# Altium schematic sheet Power.SchDoc
size 127 x 177 mm; SheetNumber: 1; SheetTotal: 5
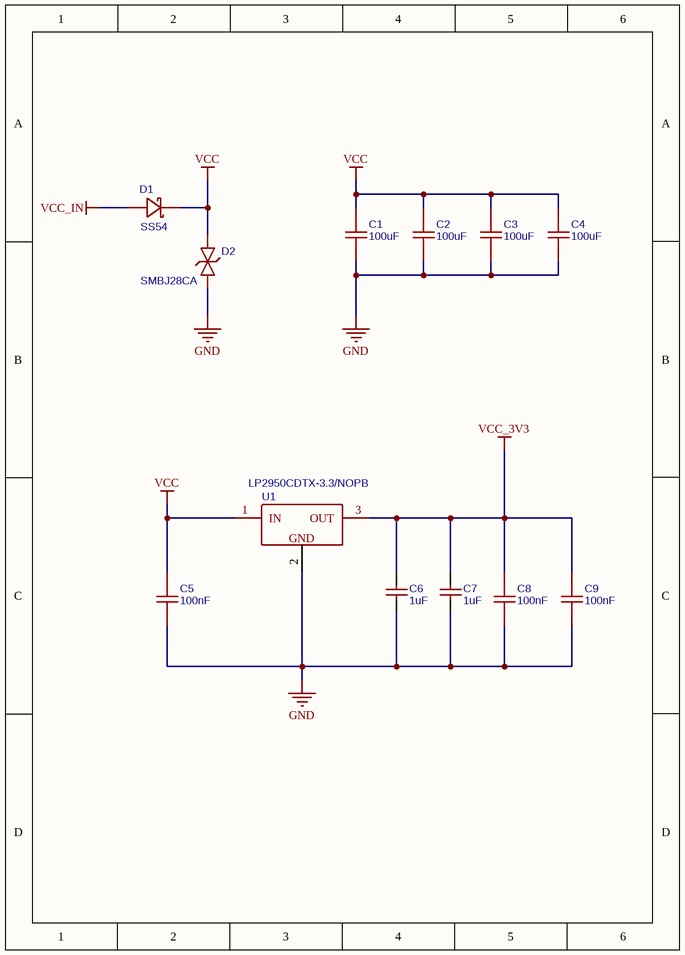
[diagram p0: Power.SchDoc]

## Parts
C1  100uF  [C1206]
C2  100uF  [C1206]
C3  100uF  [C1206]
C4  100uF  [C1206]
C5  100nF  [C0603]
C6  1uF  [C0603]
C7  1uF  [C0603]
C8  100nF  [C0603]
C9  100nF  [C0603]
D1  SS54  [SMA_L4.3-W2.6-LS5.0-RD]
D2  SMBJ28CA  [SMB_L4.6-W3.6-LS5.3-BI]
U1  LP2950CDTX-3.3/NOPB  [TO-252-2_L6.6-W6.1-P4.57-LS9.9-BR-CW]

## Nets
GND: C1.2 C2.2 C3.2 C4.2 C5.1 C6.1 C7.1 C8.1 C9.1 D2.1 U1.2(GND)
VCC: C1.1 C2.1 C3.1 C4.1 C5.2 D1.1 D2.2 U1.1(IN)
VCC_3V3: C6.2 C7.2 C8.2 C9.2 U1.3(OUT)
VCC_IN: D1.2

## Library data of the parts
C1-C4 = 100uF: BOM_Manufacturer: Murata Electronics; BOM_Manufacturer Part: GRM31CR61A107ME05L; nameAlias: Capacitance; Contributor: LCSC; BOM_Supplier: LCSC; BOM_Supplier Part: C312983; BOM_JLCPCB Part Class: Extended Part; spicePre: C; spiceSymbolName: GRM31CR61A107ME05L
C5 C8 C9 = 100nF: BOM_Manufacturer: SAMSUNG; BOM_Manufacturer Part: CL10B104KB8NNNC; nameAlias: Capacitance; BOM_Supplier: LCSC; BOM_Supplier Part: C1591; BOM_JLCPCB Part Class: Extended Part; spicePre: C; spiceSymbolName: CL10B104KB8NNNC
C6 C7 = 1uF: BOM_Manufacturer Part: CL10A105KB8NNNC; BOM_Manufacturer: SAMSUNG; nameAlias: Capacitance; BOM_Supplier: LCSC; BOM_Supplier Part: C15849; BOM_JLCPCB Part Class: Basic Part; spicePre: C; spiceSymbolName: CL10A105KB8NNNC
D1 = SS54_C727065: BOM_Manufacturer: TWGMC; Contributor: LCSC; BOM_Supplier: LCSC; BOM_Supplier Part: C727065; BOM_Manufacturer Part: SS54; BOM_JLCPCB Part Class: Extended Part; spicePre: D; spiceSymbolName: SS54_C727065
D2 = SMBJ28CA_C908204: BOM_Manufacturer: FUXINSEMI; Contributor: LCSC; BOM_Supplier: LCSC; BOM_Supplier Part: C908204; BOM_Manufacturer Part: SMBJ28CA; BOM_JLCPCB Part Class: Extended Part; spicePre: D; spiceSymbolName: SMBJ28CA_C908204
U1 = LP2950CDTX-3.3/NOPB: BOM_Manufacturer: TI; Contributor: LCSC; BOM_Supplier: LCSC; BOM_Manufacturer Part: LP2950CDTX-3.3/NOPB; BOM_Supplier Part: C129994; BOM_JLCPCB Part Class: Extended Part; spicePre: U; spiceSymbolName: LP2950CDTX-3.3/NOPB